# EAGLE design DDS_Module_r1 (EAGLE 7.7.0)
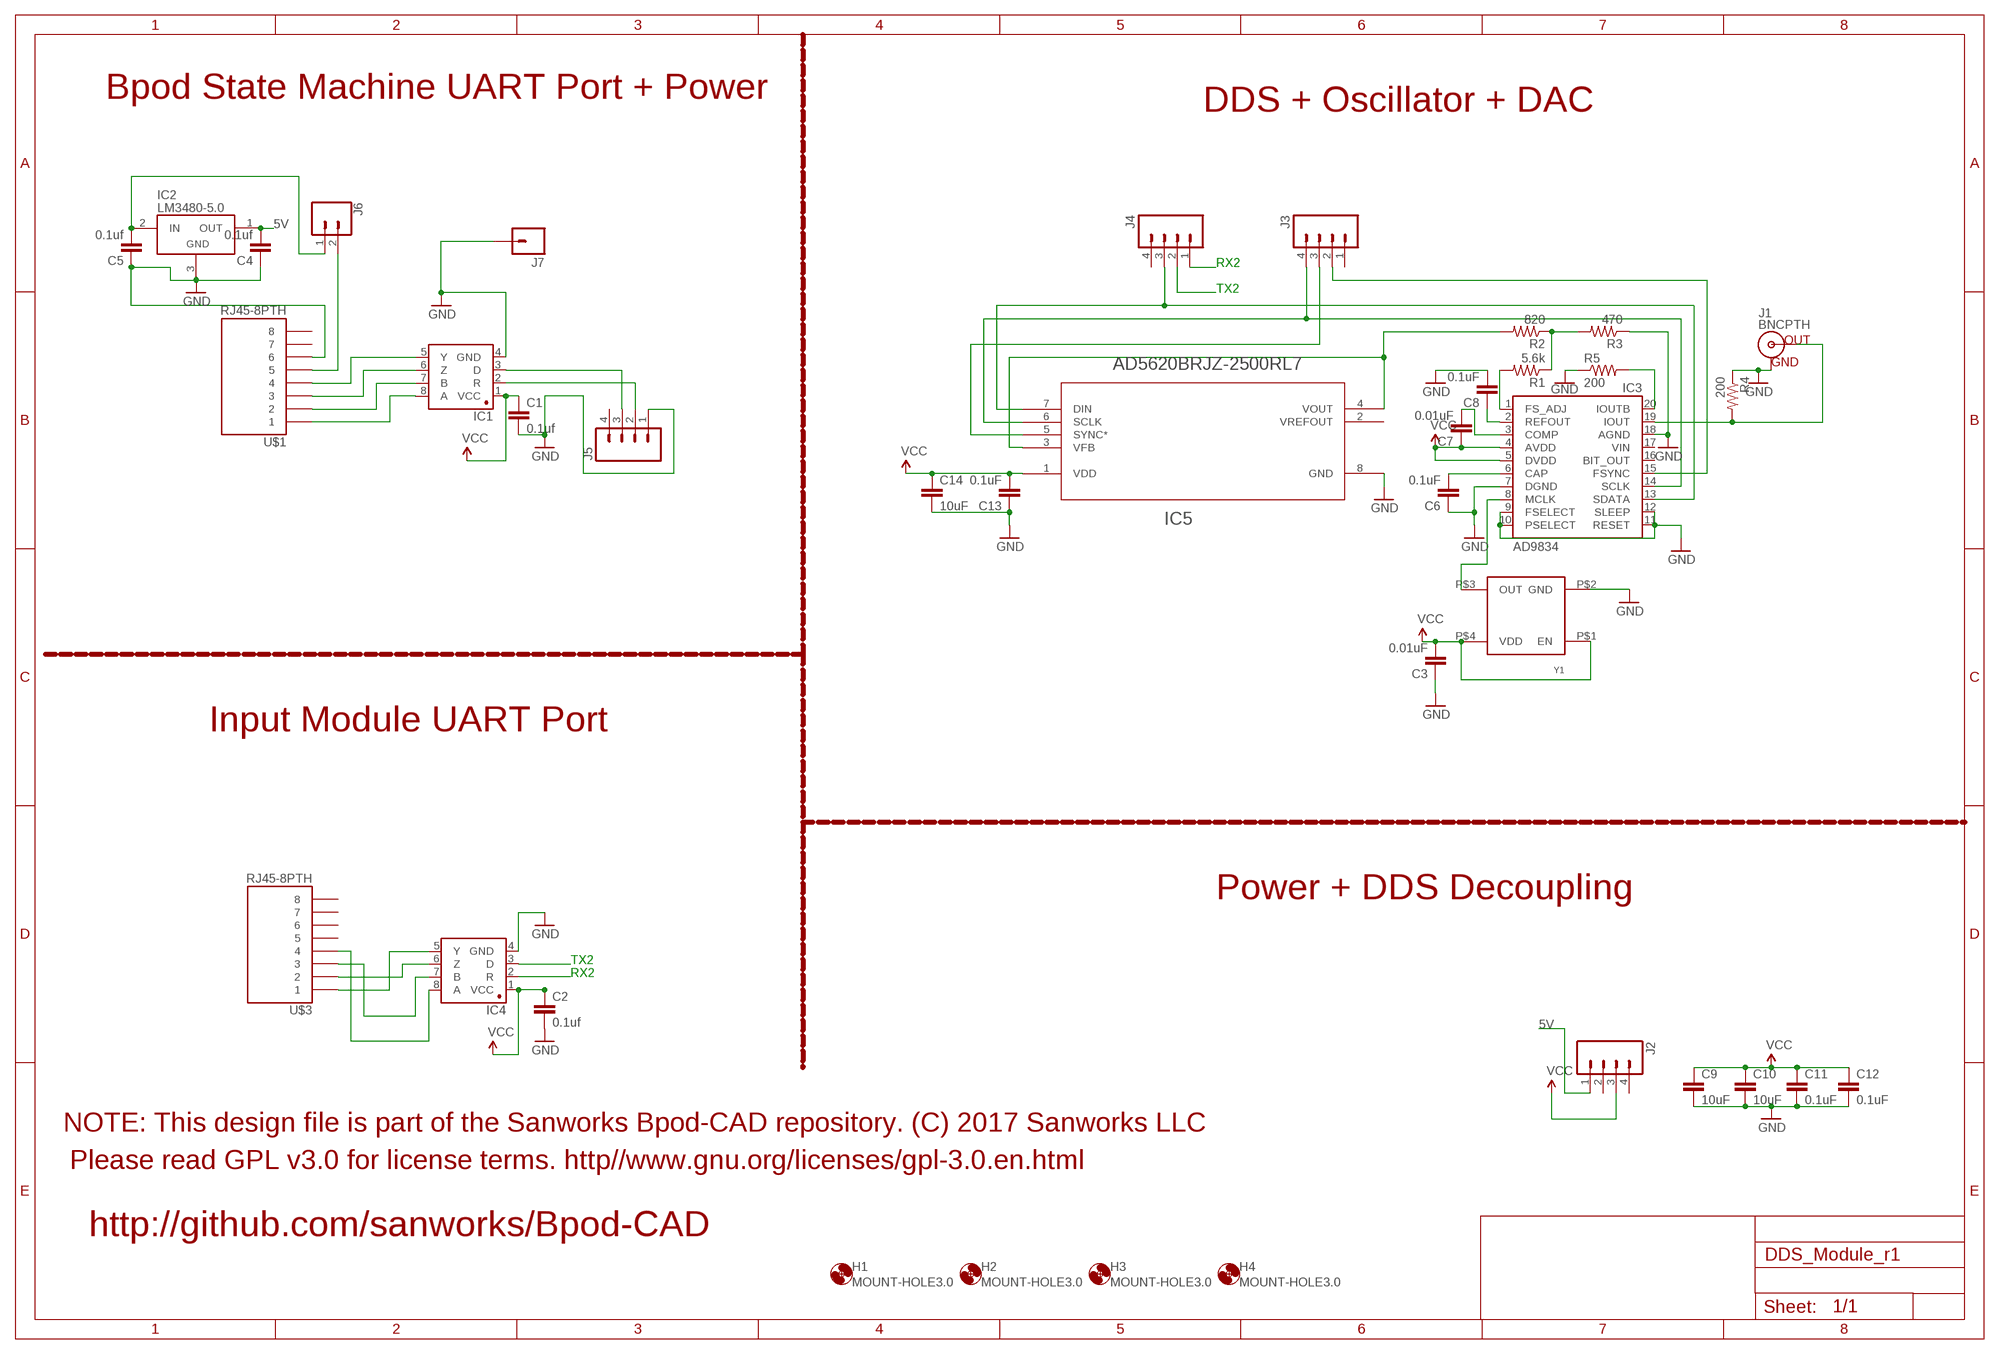
[diagram p0: schematic, sheet 1]

## Parts
C1  0.1uf  CAP1206  [1206@1]
C2  0.1uf  CAP1206  [1206@1]
C3  0.01uF  10UF-0805-10V-10%  [0805]
C4  0.1uf  CAP1206  [1206@1]
C5  0.1uf  CAP1206  [1206@1]
C6  0.1uF  10UF-0805-10V-10%  [0805]
C7  0.01uF  10UF-0805-10V-10%  [0805]
C8  0.1uF  10UF-0805-10V-10%  [0805]
C9  10uF  10UF-0805-10V-10%  [0805]
C10  10uF  10UF-0805-10V-10%  [0805]
C11  0.1uF  10UF-0805-10V-10%  [0805]
C12  0.1uF  10UF-0805-10V-10%  [0805]
C13  0.1uF  10UF-0805-10V-10%  [0805]
C14  10uF  10UF-0805-10V-10%  [0805]
H1  MOUNT-HOLE3.0  [3,0]
H2  MOUNT-HOLE3.0  [3,0]
H3  MOUNT-HOLE3.0  [3,0]
H4  MOUNT-HOLE3.0  [3,0]
IC1  SN65HVD31DR  [SO08]
IC2  LM3480-5.0  [SOT-23-3]
IC3  AD9834  [TSSOP20]
IC4  SN65HVD31DR  [SO08]
IC5  AD5620BRJZ-2500RL7  [RJ_8]
J1  BNCPTH  [BNC]
J2  M04PTH  [1X04]
J3  M04PTH  [1X04]
J4  M04PTH  [1X04]
J5  M04PTH  [1X04]
J6  CONN_02  [1X02]
J7  M01PTH  [1X01]
R1  5.6k  R-US_R0805  [R0805]
R2  820  R-US_R0805  [R0805]
R3  470  R-US_R0805  [R0805]
R4  200  R-US_R0805  [R0805]
R5  200  R-US_R0805  [R0805]
U$1  RJ45-8PTH  [RJ45-8]
U$3  RJ45-8PTH  [RJ45-8]
Y1  ASE10MHZ  [ASE10MHZ]

## Nets
5V: C4.2 IC2.1(OUT) J2.1
GND: C1.2 C2.2 C3.1 C4.1 C5.1 C6.1 C8.2 C9.2 C10.2 C11.2 C12.2 C13.1 C14.2 IC1.4(GND) IC2.3(GND) IC3.7(DGND) IC3.9(FSELECT) IC3.10(PSELECT) IC3.11(RESET) IC3.12(SLEEP) IC3.18(AGND) IC4.4(GND) IC5.8(GND) J1.GND J5.1 J7.1 R3.1 R4.1 R5.1 U$1.6 Y1.P$2(GND)
N$1: IC3.13(SDATA) IC5.7(DIN) J4.3
N$2: IC3.14(SCLK) IC5.6(SCLK) J3.4
N$3: IC5.5(SYNC*) J3.3
N$4: IC3.20(IOUTB) R5.2
N$5: IC3.15(FSYNC) J3.2
N$7: IC1.8(A) U$1.1
N$8: IC1.7(B) U$1.2
N$9: IC1.6(Z) U$1.3
N$10: IC1.5(Y) U$1.4
N$11: IC5.3(VFB) IC5.4(VOUT) R2.2
N$12: IC3.8(MCLK) Y1.P$3(OUT)
N$13: IC3.19(IOUT) J1.S(OUT) R4.2
N$15: C6.2 IC3.6(CAP)
N$16: C7.2 IC3.3(COMP)
N$17: C8.1 IC3.2(REFOUT)
N$18: IC3.1(FS_ADJ) R1.2
N$19: R1.1 R2.1 R3.2
N$21: IC4.5(Y) U$3.1
N$22: IC4.6(Z) U$3.2
N$23: IC4.7(B) U$3.3
N$24: J6.2 U$1.5
N$25: IC4.8(A) U$3.4
N$26: C5.2 IC2.2(IN) J6.1
RX1: IC1.2(R) J5.2
RX2: IC4.2(R) J4.1
TX1: IC1.3(D) J5.3
TX2: IC4.3(D) J4.2
VCC: C1.1 C2.1 C3.2 C7.1 C9.1 C10.1 C11.1 C12.1 C13.2 C14.1 IC1.1(VCC) IC3.4(AVDD) IC3.5(DVDD) IC4.1(VCC) IC5.1(VDD) J2.3 Y1.P$1(EN) Y1.P$4(VDD)
Unconnected: IC3.16(BIT_OUT) IC3.17(VIN) IC5.2(VREFOUT) J2.2 J2.4 J3.1 J4.4 J5.4 U$1.7 U$1.8 U$3.5 U$3.6 U$3.7 U$3.8

## Notes on the sheet
- Bpod State Machine UART Port + Power
- DDS + Oscillator + DAC
- 5V
- RX2
- TX2
- Input Module UART Port
- Power + DDS Decoupling
- TX2
- RX2
- 5V
- NOTE: This design file is part of the Sanworks Bpod-CAD repository. (C) 2017 Sanworks LLC
- Please read GPL v3.0 for license terms. http//www.gnu.org/licenses/gpl-3.0.en.html
- http://github.com/sanworks/Bpod-CAD

## Library data of the parts
C1 C2 C4 C5 = SparkFun-Capacitors:CAP: Capacitor Standard 0603 ceramic capacitor, and 0.1" leaded capacitor.
C3 C6-C8 C11-C13 = SparkFun-Capacitors:10UF: 10.0µF ceramic capacitors A capacitor is a passive two-terminal electrical component used to store electrical energy temporarily in an electric field.; PROD_ID: CAP-11330; VALUE: 10uF
C9 C10 C14 = SparkFun-Capacitors:10UF: 10.0µF ceramic capacitors A capacitor is a passive two-terminal electrical component used to store electrical energy temporarily in an electric field.; PROD_ID: CAP-11330
H1-H4 = holes:MOUNT-HOLE: MOUNTING HOLE with drill center marker
IC1 IC4 = Joshparts4:SN65HVD31DR: A placeholder for generic narrow & wide SOIC8 foorptints - used on the DIP adapter board.
IC2 = regulators:LM3480-*: National Semiconductor LM3480 100 mA, SOT-23, quasi-LDO linear regulator
IC3 = tft:AD9834
IC5 = AD5620:AD5620BRJZ-2500RL7; MANUFACTURER_PART_NUMBER: AD5620BRJZ2500RL7; VENDOR: Vendor
J1 = SparkFun-Connectors:BNC: BNC Right Angle Connector Mouser Part# 5227161 SparkFun Products: BNC Connector - Right Angle <https://www.sparkfun.com/products/10550>; PROD_ID: LPA-12729; SF_ID: PRT-10550
J2-J5 = SparkFun-Connectors:M04: Header 4 Standard 4-pin 0.1" header. Use with straight break away headers (SKU : PRT-00116), right angle break away headers (PRT-00553), swiss pins (PRT-00743), machine pins (PRT-00117), and female headers (PRT-00115). Molex polarized connector foot print use with SKU : PRT-08231 with associated crimp pins and housings. 1MM SMD Version SKU: PRT-10208; PROD_ID: CONN-09696
J6 = SparkFun-Connectors:CONN_02: Multi connection point. Often used as Generic Header-pin footprint for 0.1 inch spaced/style header connections On any of the 0.1 inch spaced packages, you can populate with these: Break Away Headers - Straight <https://www.sparkfun.com/products/116> (PRT-00116) Break Away Male Headers - Right Angle <https://www.sparkfun.com/products/553> (PRT-00553) Female Headers <https://www.sparkfun.com/products/115> (PRT-00115) Break Away Headers - Machine Pin <https://www.sparkfun.com/products/117> (PRT-00117) Break Away Female Headers - Swiss Machine Pin <https://www.sparkfun.com/products/743> (PRT-00743) For SCREWTERMINALS and SPRING TERMINALS visit here: Screw Terimnals on SparkFun.com <https://www.sparkfun.com/search/results?term=Screw+Terminals> (5mm/3.5mm/2.54mm spacing) This device is also useful as a general connection point to wire up your design to another part of your project. Our various solder wires solder well into these plated through hole pads. Hook-Up Wire - Assortment (Stranded, 22 AWG) <https://www.sparkfun.com/products/11375> (PRT-11375) Hook-Up Wire - Assortment (Solid Core, 22 AWG) <https://www.sparkfun.com/products/11367> (PRT-11367) View the entire wire category on our website here <https://www.sparkfun.com/categories/141> Special notes: Molex polarized connector foot print use with: PRT-08233 with associated crimp pins and housings. 2.54_SCREWTERM for use with PRT-10571. 3.5mm Screw Terminal footprints for PRT-08084 5mm Screw Terminal footprints for use with PRT-08432
J7 = SparkFun-Connectors:M01: Header 1 Standard 1-pin 0.1" header. Use with straight break away headers (SKU : PRT-00116), right angle break away headers (PRT-00553), swiss pins (PRT-00743), machine pins (PRT-00117), and female headers (PRT-00115). SMTSO-256-ET is a "flush mount" nut for a 4-40 screw. The older package used to be too tight, and did not allow it to sit properly thru the drill hit. The latest (0.165DIA) fits nice and snug.
R1-R5 = adafruit:R-US_: RESISTOR, American symbol
U$1 U$3 = SparkFun:RJ45-8: RJ45 Jack Simple RJ45, 8-pin connection - connector for common Cat5, Cat5e, and Cat6 Ethernet cables. Footprint not yet proven in production. Connector sku is PRT-00643; Breakout PCB sku is BOB-00716.
Y1 = JoshParts10:ASE10MHZ

## Board
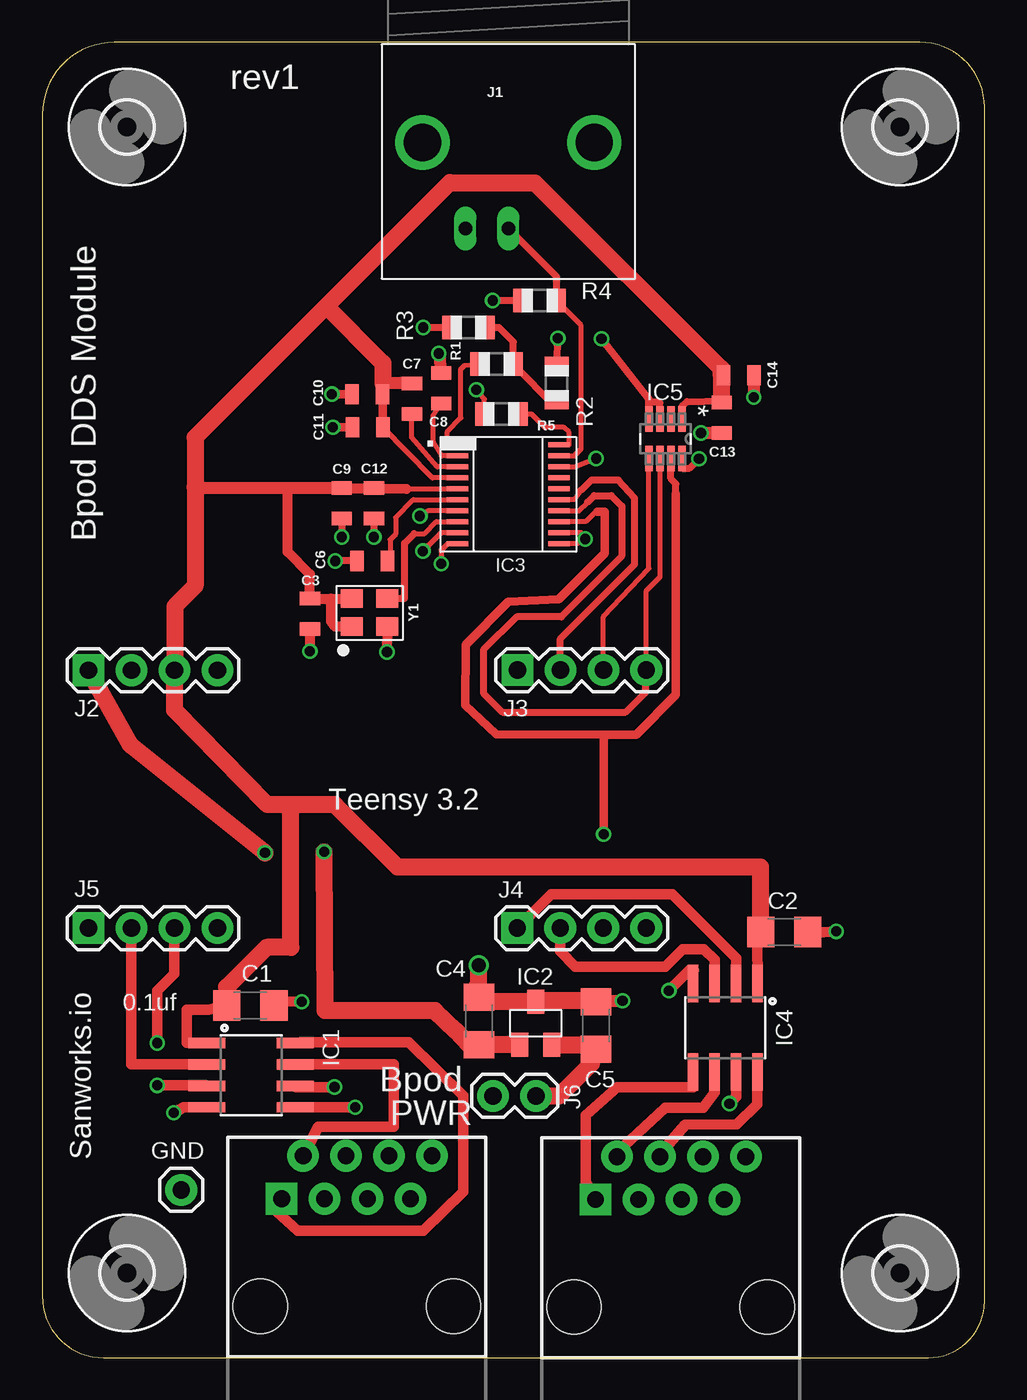
[diagram p1: board, top side]
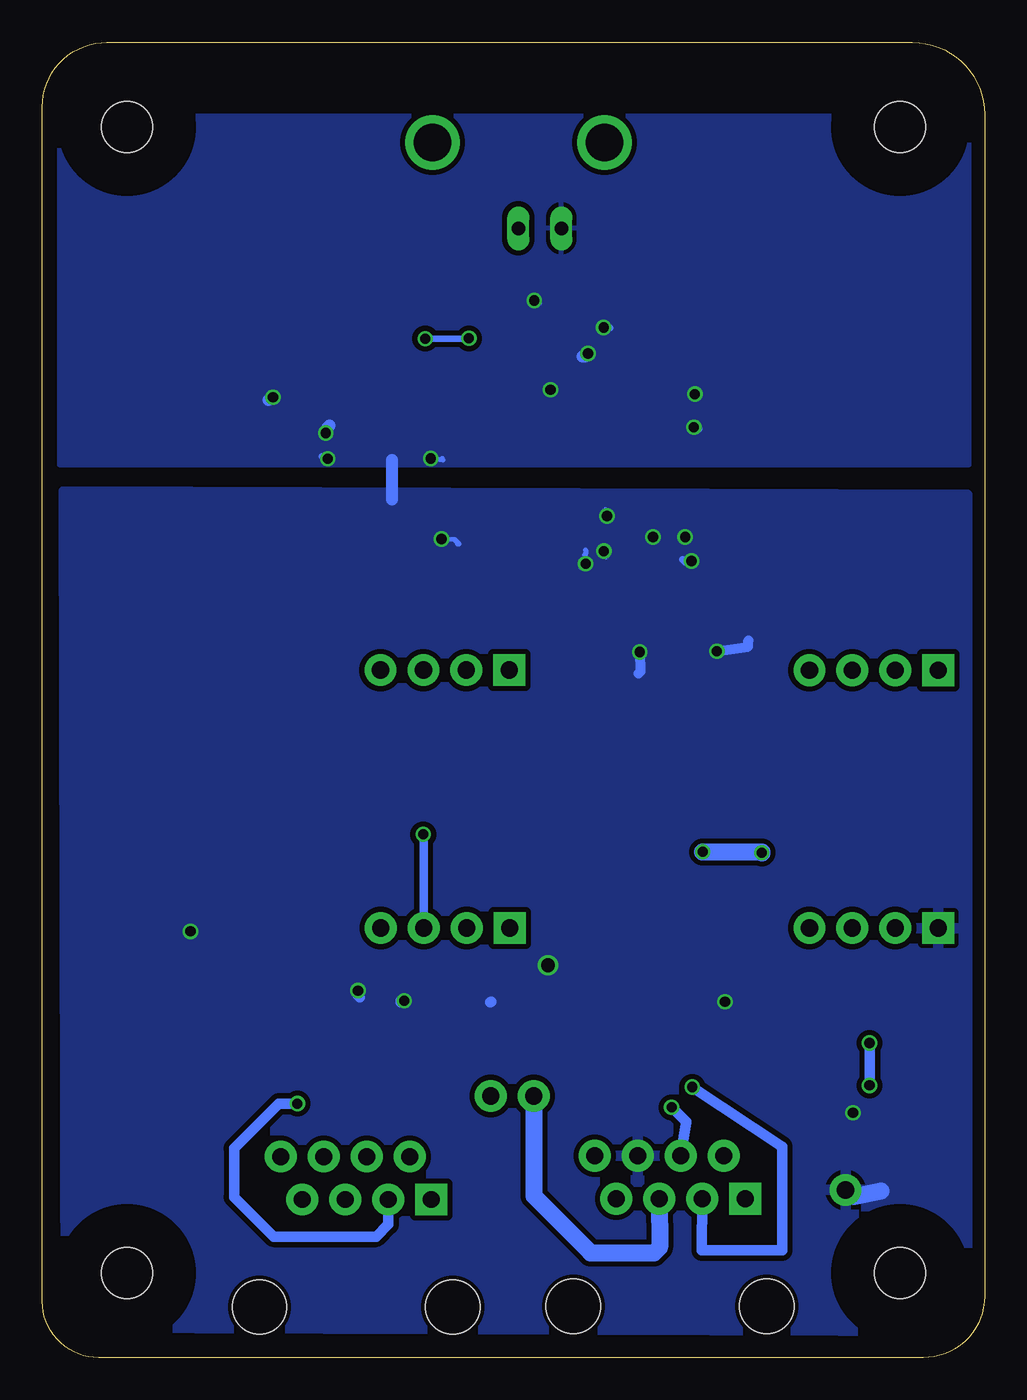
[diagram p2: board, bottom side, seen from below]

Size 55.7 x 77.76 mm. Coordinates in mm from the lower left corner, seen from the top.
Outline: 0,73.5 0,3.63 arc90 3.63,0 52.37,0 arc90 55.7,3.33 55.7,73.94 arc90 51.88,77.76 4.26,77.76 arc90 0,73.5
Copper layers (1*16): Top 0.035mm / dielectric 1.5mm / Bottom 0.035mm
Design rules "SeeedStudio_2layer_DRU_no_angle_20140221 *": minimum track width 6mil, minimum drill 12mil, track to track 12mil, track to pad 12mil, pad to pad 12mil, via to via 12mil, smd to smd 0mil, copper to edge 10mil, drill to drill 10mil, minimum pad ring 10mil, minimum via ring 6mil, stop-mask expansion 2mil, vias tented up to drill 100mil, thermal gap 10mil

### Footprints (pad centres in the part's own frame; a part is rotated, then mirrored left to right if it is on the bottom)
1206@1 = smd 1.6 x 1.8: 1 -1.4,0; 2 1.4,0
0805 = smd 0.8 x 1.2: 1 -0.9,0; 2 0.9,0
3,0 = hole 3: 0,0
SO08 = smd 0.61 x 2.21: 1 -1.905,-2.616; 2 -0.635,-2.616; 3 0.635,-2.616; 4 1.905,-2.616; 5 1.905,2.616; 6 0.635,2.616; 7 -0.635,2.616; 8 -1.905,2.616
SOT-23-3 = smd 1.016 x 1.397: 1 -0.953,-1.27; 2 0.953,-1.27; 3 0,1.27
TSSOP20 = smd 0.3 x 1.27: 1 -2.925,-3; 2 -2.275,-3; 3 -1.625,-3; 4 -0.975,-3; 5 -0.325,-3; 6 0.325,-3; 7 0.975,-3; 8 1.625,-3; 9 2.275,-3; 10 2.925,-3; 11 2.925,3; 12 2.275,3; 13 1.625,3; 14 0.975,3; 15 0.325,3; 16 -0.325,3; 17 -0.975,3; 18 -1.625,3; 19 -2.275,3; 20 -2.925,3
RJ_8 = smd 1.524 x 0.432: 1 -1.168,0.975; 2 -1.168,0.325; 3 -1.168,-0.325; 4 -1.168,-0.975; 5 1.168,-0.975; 6 1.168,-0.325; 7 1.168,0.325; 8 1.168,0.975
BNC = drill 2.2: 3 -5.08,5.08; 4 5.08,5.08 | drill 0.8 long: GND -2.54,0; S 0,0
1X04 = drill 1.016 pad 1.88 square: 1 0,0 | drill 1.016 pad 1.88: 2 2.54,0; 3 5.08,0; 4 7.62,0
1X02 = drill 1.016 pad 1.88: 1 0,0; 2 2.54,0
1X01 = drill 1.016 pad 1.88: 1 0,0
R0805 = smd 1.1 x 1.4: 1 -1,0; 2 1,0
RJ45-8 = drill 1 pad 1.88 square: 1 -4.445,6.35 | drill 1 pad 1.88: 2 -3.175,8.89; 3 -1.905,6.35; 4 -0.635,8.89; 5 0.635,6.35; 6 1.905,8.89; 7 3.175,6.35; 8 4.445,8.89 | hole 3.2: -5.715,0; 5.715,0
ASE10MHZ = smd 1.3 x 1.1: P$1 0,0; P$2 2.1,0; P$3 2.1,1.65; P$4 0,1.65

### Placement (x,y rotation side)
C1  12.3,20.81 0 top
C2  43.86,25.16 0 top
C3  15.82,43.98 90 top
C4  25.81,19.9 270 top
C5  32.73,19.65 270 top
C6  19.5,47.1 0 top
C7  21.86,56.7 270 top
C8  23.58,57.32 90 top
C9  17.7,50.5 270 top
C10  19.22,56.96 180 top
C11  19.24,55 180 top
C12  19.6,50.5 270 top
C13  40.16,55.56 90 top
C14  41.16,58.08 0 top
H1  5,5 0 top
H2  50.7,5 0 top
H3  50.7,72.76 0 top
H4  5,72.76 0 top
IC1  12.34,16.71 270 top
IC2  29.17,19.77 0 top
IC3  27.55,51.04 270 top
IC4  40.38,19.5 180 top
IC5  36.84,54.32 270 top
J1  27.55,66.76 0 top
J2  2.73,40.64 0 top
J3  28.09,40.65 0 top
J4  28.07,25.4 0 top
J5  2.73,25.4 0 top
J6  29.19,15.47 180 top
J7  8.21,9.92 0 top
R1  26.85,58.74 180 top
R2  30.41,57.61 90 top
R3  25.2,60.9 0 top
R4  29.4,62.49 0 top
R5  27.14,55.78 0 top
U$1  18.59,3.05 0 top
U$3  37.15,3 0 top
Y1  18.3,43.22 0 top

### Tracks (layer width: path | path; a pad name or v marks a point on that pad's centre or on a via)
5V  (via drill 0.6)
  Top 1: IC2.1 25.21,18.5 | 25.21,18.5 C4.2 | 25.21,18.5 24.47,19.3 23.2,20.51 16.73,20.51 v16.66,29.91 | v13.17,29.84 5.23,36.2 J2.1
  Bottom 1: v16.66,29.91 13.17,29.91 v13.17,29.84
GND  (via drill 0.6, 0.8)
  Top 0.3: IC3.7 22.79,50.06 v22.32,49.76 | IC3.12 31.88,48.76 v32.1,48.4 32.1,48.26 31.62,48.12 30.59,48.12 IC3.11 | IC3.18 31.48,52.66 v32.74,53.16 | IC3.10 23.95,48.12 23.58,47.74 v23.58,46.94 | IC3.9 23.59,48.77 v22.5,47.68 | R5.1 26.14,56.68 v25.66,57.22
  Top 0.4: R4.1 v26.63,62.49 v26.62,62.5 | C6.1 v17.32,47.1 | C9.2 v17.7,48.52 | C12.2 v19.6,48.52 | 38.81,53.15 v38.82,53.14 38.26,52.58 37.84,52.58 37.82,52.6 IC5.8
  Top 0.406: R3.1 v22.52,60.9
  Top 0.5: C11.2 v17.18,55 | C10.2 v17.12,56.96
  Top 0.6: C3.1 v15.82,41.76 | Y1.P$2 20.36,41.62 v20.38,41.72
  Top 0.625: C2.2 46.18,25.16 v46.94,25.2 | 34.15,21.05 v34.3,21.1 | 28.97,21.08 IC2.3 | C5.1 32.67,21.1 | IC4.4 38.48,22.88 38.5,22.9 38.24,22.9 v37.04,21.7
  Top 0.635: IC1.4 8.35,14.8 v7.77,14.48 | C1.2 14.02,21.06 v15.34,21.05
  Top 0.7: 32.67,21.1 v34.3,21.1 | C8.2 23.5,59.32 v23.44,59.36 | C14.2 v42.06,56.78 | C13.1 v38.94,54.66
  Top 1: v25.8,23.2 25.79,22.1 25.68,21.91 C4.1 26.06,21.08 28.97,21.08 | 32.67,21.1 29.4,21.1
  Bottom 0.3: 23.58,47.74 23.58,47.52 23.64,47.46 | v22.32,49.76 22.48,50.06 22.4,50.14 | v32.1,48.4 31.34,48.38 31.08,48.12 31.16,48.12 | v32.74,53.16 32,53.08 32.08,53.16 | v23.58,46.94 23.6,46.94 23.84,46.7 | v22.5,47.68 22.5,47.46 22.38,47.34 | v25.66,57.22 25.66,57.18 25.78,57.3
  Bottom 0.4: v26.62,62.5 26.52,62.5 26.36,62.34 | v17.32,47.1 17.84,47.18 17.66,47 | v17.7,48.52 17.74,48.6 17.78,48.64 | v19.6,48.52 19.6,48.68 19.5,48.58 | v38.82,53.14 39.04,53.14 39.16,53.26
  Bottom 0.406: v22.52,60.9 22.16,60.9 22.14,60.88
  Bottom 0.5: v17.18,55 17,55 16.92,54.92 | v17.12,56.96 17.04,56.96 17.02,56.98
  Bottom 0.6: v15.82,41.76 13.98,42.04 13.96,42.4 | v20.38,41.72 20.34,40.56 20.46,40.44
  Bottom 0.625: v34.3,21.1 34.5,21 34.5,21.1 | 29.21,21 IC2.3 | v37.04,21.7 37.04,21.42 36.94,21.32
  Bottom 0.7: v23.44,59.36 23.62,59.2 23.76,59.2 | 35.04,53.08 35.04,50.72 | v42.06,56.78 42.06,56.86 42.32,56.62 | v38.94,54.66 38.84,54.98 38.72,55.1
  Bottom 1: v25.8,23.2 25.7,23.2
  Bottom 1.016: 6.11,9.85 7.71,9.53
  pour Bottom: 1.03,1.58 54.31,1.76 54.43,51.21 1.03,51.03
  pour Bottom: 0.9,52.8 0.9,73.4 54.7,73.4 54.7,52.8
N$1  (via drill 0.6)
  Top 0.3: 32.8,50.02 32.72,50.02 32.12,49.42 IC3.13
  Top 0.4: 37.46,51.06 37.46,51.66 37.16,51.96 IC5.7
  Top 0.5: v33.18,30.94 33.18,36.82 | 33.18,36.82 26.84,36.86 25,38.56 25.02,42.16 27.54,44.7 30.52,44.84 33.26,47.56 33.26,50.02 32.8,50.02 | 37.46,51.06 37.46,39.18 35.12,36.84 33.2,36.84 33.18,36.82
  Bottom 0.5: J4.3 33.16,30.91 v33.18,30.94
N$2
  Top 0.3: J3.4 35.71,45.35 36.52,46.16 IC5.6 | IC3.14 31.72,50.06 32.24,50.58
  Top 0.4: 32.24,50.58 32.62,50.96 33.64,50.96 34.26,50.34 34.24,47.38 30.68,43.8 28.04,43.8 26.08,41.84 26.08,39.28 27.2,38.16 34.48,38.16 35.66,39.34 35.66,40.6 J3.4
N$3
  Top 0.3: J3.3 33.17,43.79 35.86,46.64 IC5.5
N$4
  Top 0.3: IC3.20 31.13,53.97 31.14,53.96 31.14,54.7 30.84,55 29.7,55 28.92,55.78 R5.2
N$5
  Top 0.3: 31.86,51.28 31.44,50.72 IC3.15
  Top 0.4: J3.2 30.63,42.51 35.02,46.9 35.02,50.82 34.06,51.88 32.46,51.88 31.86,51.28
N$7
  Top 0.635: U$1.1 13.85,8.64 15.12,7.49 22.53,7.49 24.89,9.81 24.89,15.48 21.66,18.64 15.28,18.64 IC1.8
N$8
  Top 0.635: IC1.7 20.78,17.34 20.79,14.99 20.79,13.65 16.3,13.65 U$1.2
N$9  (via drill 0.6)
  Top 0.635: v17.28,16 15.02,16 IC1.6
  Bottom 0.635: U$1.3 16.71,6.35 11.96,6.35 11.96,12.48 v17.28,16
N$10  (via drill 0.6)
  Top 0.625: v18.5,14.8 IC1.5
  Bottom 0.625: U$1.4 17.63,13.94 v18.5,14.8
N$11  (via drill 0.6)
  Top 0.4: IC5.4 35.87,56.48 | 35.87,56.48 35.87,56.7 v33.06,60.24 | v30.48,60.26 30.44,59.88 30.42,59.24 R2.2 | IC5.3 36.52,56.42 36.46,56.48 35.87,56.48
  Bottom 0.4: v33.06,60.24 v30.48,60.26
N$12
  Top 0.3: 21.98,48.72 22.6,48.72 23.3,49.42 IC3.8
  Top 0.4: 21.98,48.72 21.42,48.16 21.42,44.87 Y1.P$3
N$13
  Top 0.3: IC3.19 31.45,53.31 31.86,53.72 31.86,61.03 R4.2
  Top 0.4: R4.2 30.4,63.91 J1.S
N$15
  Top 0.3: IC3.6 21.94,50.72 20.88,49.66 20.88,48.68 20.56,48.36 20.56,47.26 C6.2
N$16
  Top 0.3: IC3.3 23.36,52.66 21.84,54.4 21.84,55.78 C7.2
N$17
  Top 0.3: IC3.2 23.61,53.31 23.12,54.14 23.1,55.7 C8.1
N$18
  Top 0.3: IC3.1 23.96,53.97 23.94,53.96 23.94,54.74 24.74,55.56 24.74,58.44 24.96,58.66 R1.2
N$19
  Top 0.406: R2.1 29.95,56.61 28.28,58.28 28.23,58.28 R1.1 27.85,60.05 27,60.9 R3.2
N$21
  Top 0.625: IC4.5 38.48,16 33.98,16 32.12,14.34 32.12,10.38 U$3.1
N$22
  Top 0.625: U$3.2 33.98,12.15 36.82,14.78 39.06,14.78 39.76,15.7 IC4.6
N$23  (via drill 0.6)
  Top 0.625: IC4.7 41.02,15.41 v40.62,15.02
  Bottom 0.625: v40.62,15.02 41.72,15.02 44.36,12.38 44.36,9.5 42.02,7.16 35.96,7.16 35.24,7.88 U$3.3
N$24
  Bottom 1: U$1.5 19.21,6.53 19.53,6.2 23.28,6.2 26.65,9.57 J6.2
N$25
  Top 0.625: U$3.4 36.52,12.02 38,13.76 41.06,13.8 42.26,14.98 42.26,16.86 IC4.8
N$26
  Top 0.7: 32.47,18.5 C5.2
  Top 1: IC2.2 32.47,18.5 | J6.1 30.55,15.47 32.48,17.4 32.48,18 C5.2
RX1
  Top 0.625: J5.2 5.27,17.34 IC1.2
RX2
  Top 0.625: IC4.2 41.02,23.62 37.24,27.4 30.07,27.4 J4.1
TX1  (via drill 0.6)
  Top 0.625: J5.3 7.81,22.71 6.8,21.7 v6.8,18.6 | v6.8,16.1 9.65,16.1 IC1.3
  Bottom 0.625: v6.8,18.6 v6.8,16.1
TX2
  Top 0.625: IC4.3 39.75,23.52 39.1,24.16 37.86,24.16 36.82,23.12 31.52,23.12 30.62,24.02 J4.2
VCC
  Top 0.3: 21.52,51.36 24.52,51.36 IC3.5 | IC3.4 23.06,52.02 C11.1
  Top 0.4: IC5.1 37.82,56.23 38.12,56.52 40.16,56.56 40.2,56.48 C13.2 | C14.1 40.3,58 40.15,58.47
  Top 0.5: C11.1 20.14,56.94 C10.1
  Top 0.6: C9.1 C12.1 21.52,51.36 | 17.06,44.88 C3.2 15.82,46.32 14.5,47.64 14.5,51.36 14.54,51.4 | 17.06,44.88 Y1.P$4 | Y1.P$1 17.3,43.22 17.08,43.52 17.08,44.82 17.06,44.88
  Top 0.625: C2.1 42.26,24.74 IC4.1
  Top 0.635: IC1.1 8.53,18.61 8.53,20.57 9.8,20.57 C1.1
  Top 0.7: 20.14,56.94 20.14,57.6 C7.1 | C9.1 14.54,51.4 9.12,51.4 9.04,51.48
  Top 1: 14.69,32.7 14.69,24.26 13.26,24.26 10.9,21.9 C1.1 | C2.1 42.46,29 21,29 17.3,32.7 14.69,32.7 | 16.79,62.15 24.1,69.46 24.12,69.44 29.14,69.44 40.15,58.47 40.16,57.6 40.16,56.56 | 16.79,62.15 9.04,54.4 9.04,51.48 9.04,45.62 7.84,44.42 7.84,40.67 J2.3 7.82,38.28 13.3,32.7 14.69,32.7 | 16.79,62.15 20.14,58.8 20.14,57.6

### Text on the board
tPlace: rev1 | Bpod DDS Module | IC5 | . | Teensy 3.2 | Sanworks.io | 0.1uf | Bpod | PWR | GND